# Altium schematic sheet 1_系统电源.SchDoc
size A4
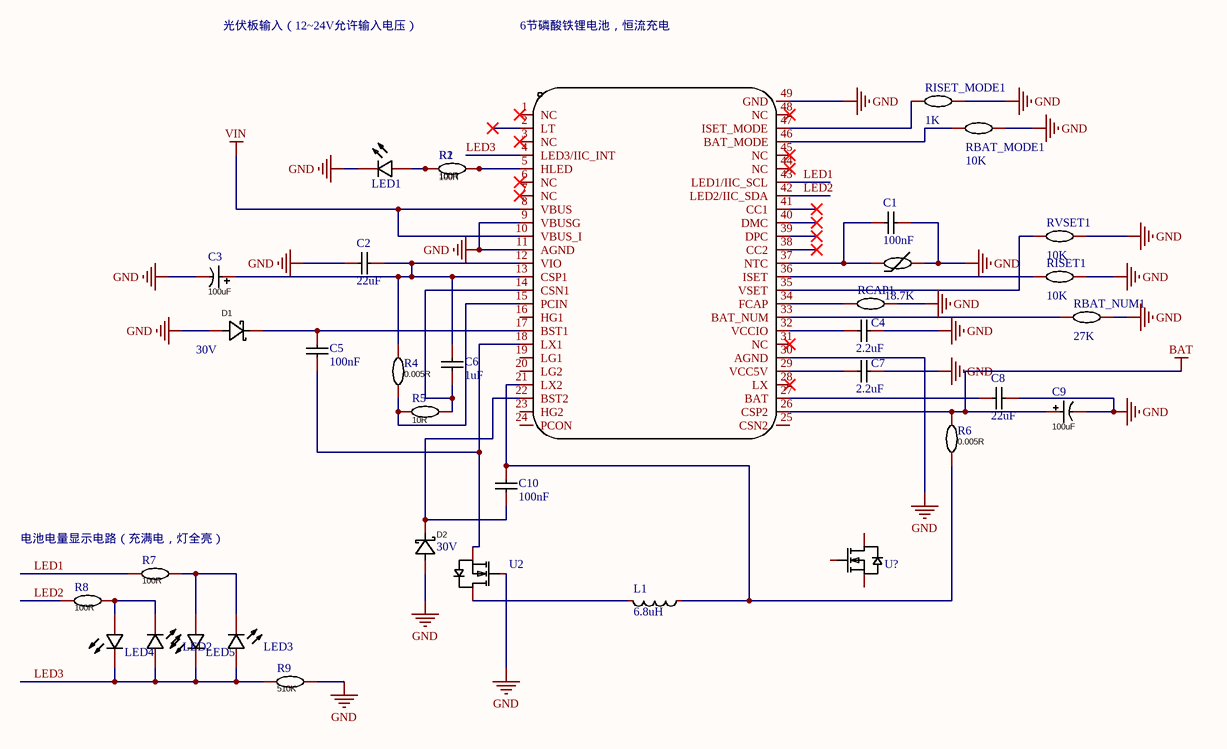
[diagram p0: 1_系统电源.SchDoc]

## Parts
C1  100nF  [0603]
C2  Name: 22uF  [0603]  (hidden comment: 100nF)
C3  100uF  [CAP-SMD_BD6.3-L6.6-W6.6-FD]
C4  Name: 2.2uF  [0603]  (hidden comment: 100nF)
C5  100nF  [0603]
C6  Name: 1uF  [0603]  (hidden comment: 100nF)
C7  Name: 2.2uF  [0603]  (hidden comment: 100nF)
C8  Name: 22uF  [0603]  (hidden comment: 100nF)
C9  100uF  [CAP-SMD_BD6.3-L6.6-W6.6-FD]
C10  100nF  [0603]
D1  30V  [SOD-123FL_L2.8-W1.8-LS3.7-RD]
D2  30V  [SOD-123FL_L2.8-W1.8-LS3.7-RD]
L1  6.8uH  [IND-SMD_L12.0-W12.0]
LED1  XL-1608SURC-06  [LED0603-RD_RED]  (value not drawn)
LED2  XL-1608SURC-06  [LED0603-RD_RED]  (value not drawn)
LED3  XL-1608SURC-06  [LED0603-RD_RED]  (value not drawn)
LED4  XL-1608SURC-06  [LED0603-RD_RED]  (value not drawn)
LED5  XL-1608SURC-06  [LED0603-RD_RED]  (value not drawn)
R1  Resistance: 100R  [0603R]  (hidden comment: 0603WAF1002T5E)
R2  Resistance: 100R  [0603R]  (hidden comment: 0603WAF1002T5E)
R3  NCP18XH103F03RB  [0603R]  (value not drawn)
R4  Resistance: 0.005R  [R1206]  (hidden comment: 0603WAF1002T5E)
R5  Resistance: 10R  [0603R]  (hidden comment: 0603WAF1002T5E)
R6  Resistance: 0.005R  [R1206]  (hidden comment: 0603WAF1002T5E)
R7  Resistance: 100R  [0603R]  (hidden comment: 0603WAF1002T5E)
R8  Resistance: 100R  [0603R]  (hidden comment: 0603WAF1002T5E)
R9  Resistance: 510K  [0603R]  (hidden comment: 0603WAF1002T5E)
RBAT_MODE1  Name: 10K  [0603R]  (hidden comment: 0603WAF1002T5E)
RBAT_NUM1  Name: 27K  [0603R]  (hidden comment: 0603WAF1002T5E)
RCAP1  Name: 18.7K  [0603R]  (hidden comment: 0603WAF1002T5E)
RISET1  Name: 10K  [0603R]  (hidden comment: 0603WAF1002T5E)
RISET_MODE1  Name: 1K  [0603R]  (hidden comment: 0603WAF1002T5E)
RVSET1  Name: 10K  [0603R]  (hidden comment: 0603WAF1002T5E)
U1  IP2368_BZ_VGLIP  [QFN-48_L7.0-W7.0-P0.50-TL-EP5.4-1]  (value not drawn)
U2  2N7002  [SOT-23-3_L2.9-W1.3-P1.90-LS2.4-BR]  (value not drawn)
U?  2N7002  [SOT-23-3_L2.9-W1.3-P1.90-LS2.4-BR]  (value not drawn)

## Nets
BAT: C9.1 R6.2 U1.26(CSP2)
GND: C1.2 C2.2 C3.2 C4.2 C7.2 C8.2 C9.2 D1.2(A) D2.2(A) LED1.1(C) R3.2 R9.2 RBAT_MODE1.2 RBAT_NUM1.2 RCAP1.2 RISET1.2 RISET_MODE1.2 RVSET1.2 U1.9(VBUSG) U1.11(AGND) U1.30(AGND) U1.49(GND) U2.1(G)
VIN: U1.8(VBUS) U1.10(VBUS_I)
LED1: R7.1 U1.43(LED1/IIC_SCL)
LED2: R8.1 U1.42(LED2/IIC_SDA)
LED3: LED2.2(A) LED3.2(A) LED4.1(C) LED5.1(C) R9.1 U1.4(LED3/IIC_INT)
NetC1_1: C1.1 R3.1 U1.37(NTC)
NetC2_1: C2.1 C3.1 C6.2 R4.2 U1.12(VIO) U1.13(CSP1)
NetC4_1: C4.1 U1.32(VCCIO)
NetC5_1: C5.1 U1.18(LX1) U2.2(S)
NetC5_2: C5.2 D1.1(K) U1.17(BST1)
NetC6_1: C6.1 R5.2 U1.14(CSN1)
NetC7_1: C7.1 U1.29(VCC5V)
NetC8_1: C8.1 U1.27(BAT)
NetC10_1: C10.1 D2.1(K) U1.22(BST2)
NetC10_2: C10.2 L1.1 R6.1 U1.21(LX2)
NetL1_2: L1.2 U2.3(D)
NetLED1_2: LED1.2(A) R1.1 R2.1
NetLED2_1: LED2.1(C) LED4.2(A) R8.2
NetLED3_1: LED3.1(C) LED5.2(A) R7.2
NetR1_2: R1.2 R2.2 U1.5(HLED)
NetR4_1: R4.1 R5.1 U1.15(PCIN)
NetRBAT_MODE1_1: RBAT_MODE1.1 U1.46(BAT_MODE)
NetRBAT_NUM1_1: RBAT_NUM1.1 U1.33(BAT_NUM)
NetRCAP1_1: RCAP1.1 U1.34(FCAP)
NetRISET1_1: RISET1.1 U1.36(ISET)
NetRISET_MODE1_1: RISET_MODE1.1 U1.47(ISET_MODE)
NetRVSET1_1: RVSET1.1 U1.35(VSET)

Not connected (* = marked no-connect by the designer): U1 1(NC)* 2(LT)* 3(NC)* 6(NC)* 7(NC)* 16(HG1) 19(LG1) 20(LG2) 23(HG2) 24(PCON) 25(CSN2) 28(LX)* 31(NC)* 38(CC2)* 39(DPC)* 40(DMC)* 41(CC1)* 44(NC)* 45(NC)* 48(NC)*; U? 1(G) 2(S) 3(D)

## Notes on the sheet
- 光伏板输入（12~24V允许输入电压）
- 6节磷酸铁锂电池，恒流充电
- (near R7) 电池电量显示电路（充满电，灯全亮）

## Library data of the parts
C1 C2 C4-C8 C10 = 0603B104K500NT: Manufacturer: FH; Convert to PCB: yes; Origin Footprint: C0603; Symbol: 100nF; Device: 0603B104K500NT; Supplier: LCSC; Manufacturer Part: 0603B104K500NT; Supplier Part: C30926; JLCPCB Part Class: Extended Part; Add into BOM: yes
  C1 C5 C10: Name: 100nF
C3 C9 = CL31A226KAHNNNE: Add into BOM: yes; Temperature Coefficient: X5R; Voltage Rated: 25V; Origin Footprint: CAP-TH_BD4.0-P1.50-D0.8-FD; Symbol: 22uF; Device: CL31A226KAHNNNE; Supplier Part: C12891; Manufacturer Part: CL31A226KAHNNNE; Supplier Footprint: 1206; JLCPCB Part Class: Extended Part; Datasheet: https://atta.szlcsc.com/upload/public/pdf/source/20160103/1457707667836.pdf; Supplier: LCSC; Convert to PCB: yes; Value: 100uF
D1 D2 = SMF75A_C5116416: Manufacturer Part: SMF75A; Add into BOM: yes; Reverse Stand-Off Voltage (Vrwm): 75V; Maximum Clamping Voltage: 121V; Peak Pulse Current (Ipp)@10/1000us: 1.4A; Peak Pulse Power Dissipation (Ppp)@10/1000us: 200W; Breakdown Voltage: 92.1V; Reverse Leakage Current (Ir): 1uA; Symbol: SMF75A_C5116416; Device: SMF75A_C5116416; Supplier: LCSC; Supplier Part: C5116416; Supplier Footprint: SOD-123FL; JLCPCB Part Class: Extended Part; Datasheet: https://atta.szlcsc.com/upload/public/pdf/source/20220715/82D6503F9C43F0DF9BB8970EC229759F.pdf; Convert to PCB: yes
L1 = SDRH.1207.NLF6R8MT00: Add into BOM: yes; Rated Current: 6.5A; Symbol: SDRH.1207.NLF6R8MT00; Device: SDRH.1207.NLF6R8MT00; Supplier Part: C2942306; Manufacturer Part: SDRH.1207.NLF6R8MT00; Supplier Footprint: SMD,12x12mm; JLCPCB Part Class: Extended Part; Datasheet: https://atta.szlcsc.com/upload/public/pdf/source/20220117/7DF2F95CA0318327D9DA3D2F3A34BD2A.pdf; Supplier: LCSC; Convert to PCB: yes; Value: 6.8uH; Saturation Current (Isat): 6.5A; Name: 6.8uH
LED1-LED5 = XL-1608SURC-06: Symbol: 19-213/Y2C-CQ2R2L/3T(CY); Add into BOM: yes; Dominant Wavelength: 617nm~621nm; Peak Wavelength: 623nm; Forward Current: 25mA; Power Dissipation: 55mW; Luminous Intensity (IF=20mA): 80~100mcd; Dominant Wavelength / Coordinate rank: 615~630nm; Forward Voltage (VF): 2.2V; Luminous Intensity: 28.5mcd; Device: XL-1608SURC-06; Supplier Part: C965799; Manufacturer Part: XL-1608SURC-06; Supplier Footprint: 0603; JLCPCB Part Class: Extended Part; Datasheet: https://atta.szlcsc.com/upload/public/pdf/source/20221102/D860AFDD1CDB02C5A8064103A32707E2.pdf; Supplier: LCSC; Convert to PCB: yes; Color Temperature: -; Diode Configuration: -; Name: XL-1608SURC-06
R1 R2 R4-R9 RISET1 RVSET1 = 0603WAF1002T5E: Manufacturer: UniOhm; Convert to PCB: yes; Origin Footprint: R0603; Device: 0603WAF1002T5E; Supplier: LCSC; Manufacturer Part: 0603WAF1002T5E; Supplier Part: C25804; JLCPCB Part Class: Basic Part; Add into BOM: yes
  RISET1 RVSET1: Resistance: 10K
R3 = NCP18XH103F03RB: Add into BOM: yes; Power: 100mW; Steady State Current (Max): 310uA; Symbol: NCP18XH103F03RB; Device: NCP18XH103F03RB; Supplier: LCSC; Manufacturer Part: NCP18XH103F03RB; Supplier Part: C13564; JLCPCB Part Class: Extended Part; Supplier Footprint: 0603; Convert to PCB: yes
RBAT_MODE1 = 0603WAF1002T5E: Manufacturer: UniOhm; Resistance: 27K; Convert to PCB: yes; Origin Footprint: R0603; Device: 0603WAF1002T5E; Supplier: LCSC; Manufacturer Part: 0603WAF1002T5E; Supplier Part: C25804; JLCPCB Part Class: Basic Part; Add into BOM: yes
RBAT_NUM1 RCAP1 RISET_MODE1 = 0603WAF1002T5E: Manufacturer: UniOhm; Resistance: 10K; Convert to PCB: yes; Origin Footprint: R0603; Device: 0603WAF1002T5E; Supplier: LCSC; Manufacturer Part: 0603WAF1002T5E; Supplier Part: C25804; JLCPCB Part Class: Basic Part; Add into BOM: yes
U1 = IP2368_BZ_VGLIP: Add into BOM: yes; Symbol: IP2368_BZ_VGLIP; Device: IP2368_BZ_VGLIP; Supplier: LCSC; Supplier Part: C7545631; Manufacturer Part: IP2368_BZ_VGLIP; JLCPCB Part Class: Extended Part; LCSC Part Name: IP2368_BZ_VGLIP; Supplier Footprint: QFN-48(7x7); Datasheet: https://atta.szlcsc.com/upload/public/pdf/source/20230829/96F1FEC23EF891AD6B658E36B913DD01.pdf; Convert to PCB: yes
U2 U? = 2N7002: Symbol: 2N7002_C727149; Add into BOM: yes; Device: 2N7002; LCSC Part Name: 2N7002; Supplier Part: C727149; Manufacturer Part: 2N7002; Supplier Footprint: SOT23; JLCPCB Part Class: Extended Part; Datasheet: https://atta.szlcsc.com/upload/public/pdf/source/20200827/C727149_F88DE2A79720D5B1ACE833184507B038.pdf; Supplier: LCSC; Convert to PCB: yes; Type: -; Drain Source Voltage (Vdss): -; Continuous Drain Current (Id): -; Power Dissipation (Pd): -; Drain Source On Resistance (RDS(on)@Vgs,Id): -; Gate Threshold Voltage (Vgs(th)@Id): -; Total Gate Charge (Qg@Vgs): -; Input Capacitance (Ciss@Vds): -; Reverse Transfer Capacitance (Crss@Vds): -; Name: 2N7002